# Altium schematic sheet Sensors.SchDoc
size A4; SheetNumber: 3; SheetTotal: 6
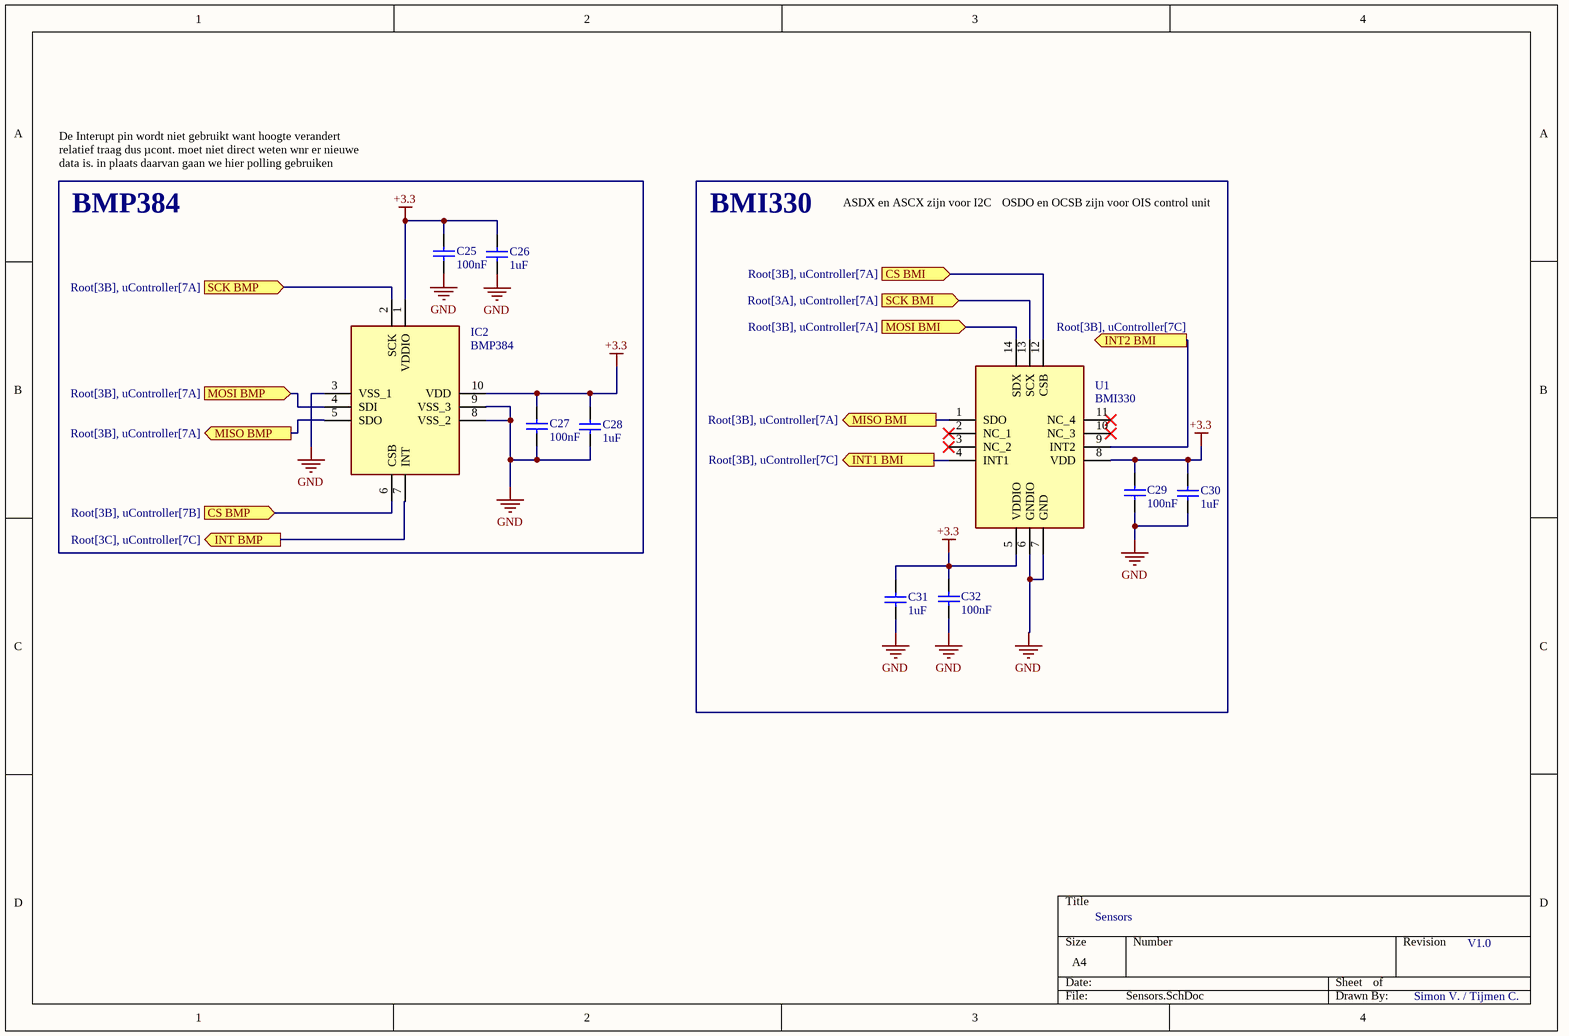
[diagram p0: Sensors.SchDoc]

## Parts
C25  100nF  [CAPC1608X92X38ML15T08]
C26  1uF  [CAPC1608X90X35NL15T15]
C27  100nF  [CAPC1608X92X38ML15T08]
C28  1uF  [CAPC1608X90X35NL15T15]
C29  100nF  [CAPC1608X92X38ML15T08]
C30  1uF  [CAPC1608X90X35NL15T15]
C31  1uF  [CAPC1608X90X35NL15T15]
C32  100nF  [CAPC1608X92X38ML15T08]
IC2  BMP384  [BMP384]
U1  BMI330  [BMI330]

## Ports
CS BMI (in, see Root[3B], uController[7A]), CS BMP (in, see Root[3B], uController[7B]), INT1 BMI (out, see Root[3B], uController[7C]), INT2 BMI (out, see Root[3B], uController[7C]), INT BMP (out, see Root[3C], uController[7C]), MISO BMI (out, see Root[3B], uController[7A]), MISO BMP (out, see Root[3B], uController[7A]), MOSI BMI (in, see Root[3B], uController[7A]), MOSI BMP (in, see Root[3B], uController[7A]), SCK BMI (in, see Root[3A], uController[7A]), SCK BMP (in, see Root[3B], uController[7A])

## Nets
+3.3: C25.2 C26.2 C27.2 C28.2 C29.2 C30.2 C31.2 C32.2 IC2.1(VDDIO) IC2.10(VDD) U1.5(VDDIO) U1.8(VDD)
GND: C25.1 C26.1 C27.1 C28.1 C29.1 C30.1 C31.1 C32.1 IC2.3(VSS_1) IC2.8(VSS_2) IC2.9(VSS_3) U1.6(GNDIO) U1.7(GND)
CS BMI: U1.12(CSB) ; port CS BMI
CS BMP: IC2.6(CSB) ; port CS BMP
INT1 BMI: U1.4(INT1) ; port INT1 BMI
INT2 BMI: U1.9(INT2) ; port INT2 BMI
INT BMP: IC2.7(INT) ; port INT BMP
MISO BMI: U1.1(SDO) ; port MISO BMI
MISO BMP: IC2.5(SDO) ; port MISO BMP
MOSI BMI: U1.14(SDX) ; port MOSI BMI
MOSI BMP: IC2.4(SDI) ; port MOSI BMP
SCK BMI: U1.13(SCX) ; port SCK BMI
SCK BMP: IC2.2(SCK) ; port SCK BMP

Not connected (* = marked no-connect by the designer): U1 2(NC_1)* 3(NC_2)* 10(NC_3)* 11(NC_4)*

## Notes on the sheet
- De Interupt pin wordt niet gebruikt want hoogte verandert relatief traag dus µcont. moet niet direct weten wnr er nieuwe data is. in plaats daarvan gaan we hier polling gebruiken
- BMP384
- BMI330
- ASDX en ASCX zijn voor I2C
- OSDO en OCSB zijn voor OIS control unit
- Sensors
- V1.0
- Simon V. / Tijmen C.

## Library data of the parts
C25 C27 C29 C32 = CMP-2006-01140-1: Part Number: VJ0603Y104MXXAC; Manufacturer: Vitramon
C26 C28 C30 C31 = CMP-2006-04534-1: Part Number: 0603YD105MAT2A; Manufacturer: AVX Interconnect / Elco
IC2 = BMP384: Integrated Circuit; Manufacturer_Name: BOSCH; Datasheet Link: https://www.mouser.in/datasheet/2/783/bst_bmp384_ds003-1954011.pdf; Height: 1mm; Manufacturer_Part_Number: BMP384; Mouser Part Number: 262-BMP384; Mouser Price/Stock: https://www.mouser.co.uk/ProductDetail/Bosch-Sensortec/BMP384?qs=IS%252B4QmGtzzqB3KCclqIEVQ%3D%3D; Arrow Part Number: BMP384; Arrow Price/Stock: https://www.arrow.com/en/products/bmp384/bosch-sensortec?utm_currency=USD&region=nac
U1 = BMI330: Undefined or Miscellaneous; Manufacturer_Name: BOSCH; Datasheet Link: https://www.digikey.ph/en/products/detail/bosch-sensortec/BMI330/26795906?msockid=3bdc366bbe0663d83c1223c0bf3662a6; Height: 0.87mm; Manufacturer_Part_Number: BMI330; Arrow Part Number: BMI330; Arrow Price/Stock: https://www.arrow.com/en/products/bmi330/bosch-sensortec?utm_currency=USD&region=nac